# Altium schematic sheet Sheet1.SchDoc
size A4
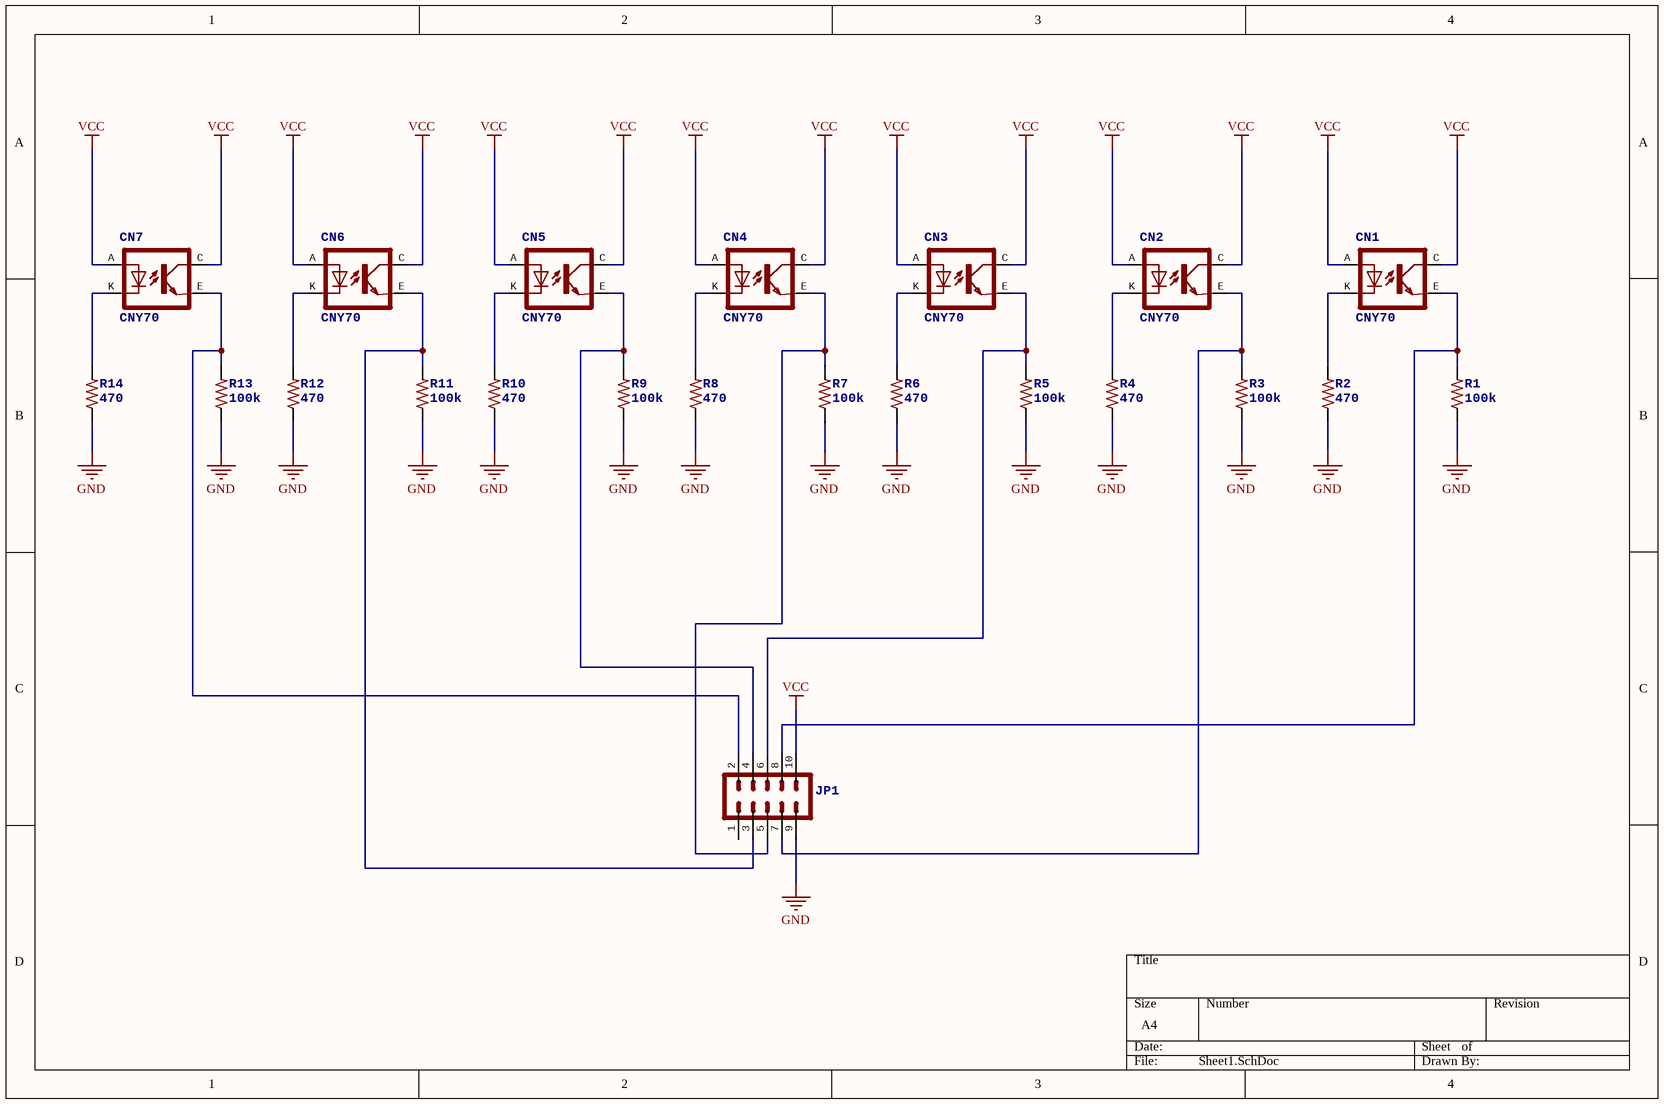
[diagram p0: Sheet1.SchDoc]

## Parts
CN1  CNY70  [cny70]
CN2  CNY70  [cny70]
CN3  CNY70  [cny70]
CN4  CNY70  [cny70]
CN5  CNY70  [cny70]
CN6  CNY70  [cny70]
CN7  CNY70  [cny70]
JP1  Header 5x2Standard 10-pin dual row 0.1" header. Commonly used with AVR-ISP. Use with Spark Fun Electronics SKU: PRT-00778  [2X5-SHROUDED_LOCK]  (value not drawn)
R1  100k  [AXIAL-0.4]
R2  470  [AXIAL-0.4]
R3  100k  [AXIAL-0.4]
R4  470  [AXIAL-0.4]
R5  100k  [AXIAL-0.4]
R6  470  [AXIAL-0.4]
R7  100k  [AXIAL-0.4]
R8  470  [AXIAL-0.4]
R9  100k  [AXIAL-0.4]
R10  470  [AXIAL-0.4]
R11  100k  [AXIAL-0.4]
R12  470  [AXIAL-0.4]
R13  100k  [AXIAL-0.4]
R14  470  [AXIAL-0.4]

## Nets
GND: JP1.9 R1.P$1 R2.P$1 R3.P$1 R4.P$1 R5.P$1 R6.P$1 R7.P$1 R8.P$1 R9.P$1 R10.P$1 R11.P$1 R12.P$1 R13.P$1 R14.P$1
VCC: CN1.A CN1.C(COL) CN2.A CN2.C(COL) CN3.A CN3.C(COL) CN4.A CN4.C(COL) CN5.A CN5.C(COL) CN6.A CN6.C(COL) CN7.A CN7.C(COL) JP1.10
NetCN1_E: CN1.E(EMI) JP1.8 R1.P$2
NetCN1_K: CN1.K(C) R2.P$2
NetCN2_E: CN2.E(EMI) JP1.7 R3.P$2
NetCN2_K: CN2.K(C) R4.P$2
NetCN3_E: CN3.E(EMI) JP1.6 R5.P$2
NetCN3_K: CN3.K(C) R6.P$2
NetCN4_E: CN4.E(EMI) JP1.5 R7.P$2
NetCN4_K: CN4.K(C) R8.P$2
NetCN5_E: CN5.E(EMI) JP1.4 R9.P$2
NetCN5_K: CN5.K(C) R10.P$2
NetCN6_E: CN6.E(EMI) JP1.3 R11.P$2
NetCN6_K: CN6.K(C) R12.P$2
NetCN7_E: CN7.E(EMI) JP1.2 R13.P$2
NetCN7_K: CN7.K(C) R14.P$2

Not connected (* = marked no-connect by the designer): JP1 1

## Library data of the parts
JP1 = M05X2SHD_LOCK
R1-R14 = RESISTORPTH-1/4W